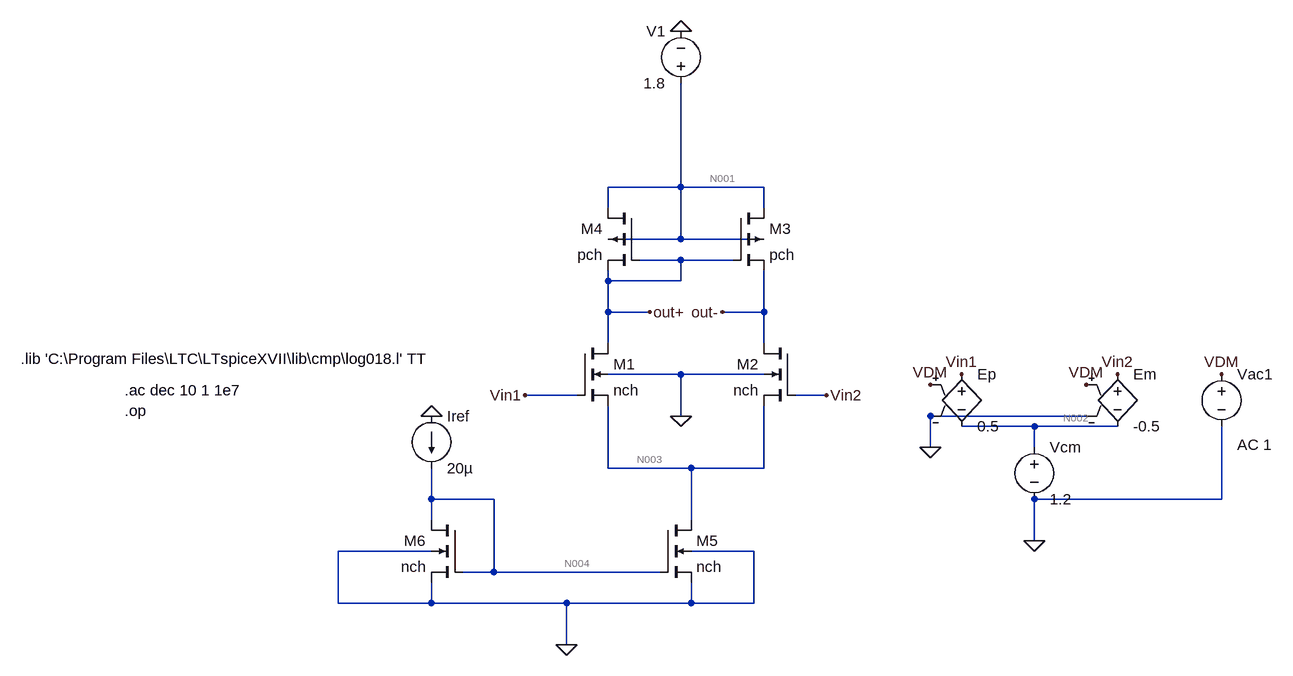
[diagram p0: schematic e3.1_dm.asc]
e3.1_dm.asc, the LTspice schematic file:
Version 4
SHEET 1 1180 692
WIRE 224 -32 224 -192
WIRE 224 -32 112 -32
WIRE 352 -32 224 -32
WIRE 112 0 112 -32
WIRE 352 0 352 -32
WIRE 224 48 224 -32
WIRE 224 48 112 48
WIRE 352 48 224 48
WIRE 224 80 160 80
WIRE 304 80 224 80
WIRE 112 112 112 96
WIRE 224 112 224 80
WIRE 224 112 112 112
WIRE 112 160 112 112
WIRE 176 160 112 160
WIRE 352 160 352 96
WIRE 352 160 288 160
WIRE 112 208 112 160
WIRE 352 208 352 160
WIRE 224 256 112 256
WIRE 352 256 224 256
WIRE 64 288 -16 288
WIRE 448 288 400 288
WIRE 224 320 224 256
WIRE 848 320 608 320
WIRE 768 336 656 336
WIRE 896 336 768 336
WIRE 608 368 608 320
WIRE 768 368 768 336
WIRE 112 400 112 304
WIRE 240 400 112 400
WIRE 352 400 352 304
WIRE 352 400 240 400
WIRE -160 448 -160 400
WIRE -64 448 -160 448
WIRE 1056 448 1056 336
WIRE 1056 448 768 448
WIRE -160 480 -160 448
WIRE 240 480 240 400
WIRE 768 512 768 448
WIRE -160 528 -304 528
WIRE 336 528 240 528
WIRE -64 560 -64 448
WIRE -64 560 -112 560
WIRE 192 560 -64 560
WIRE -304 608 -304 528
WIRE -160 608 -160 576
WIRE -160 608 -304 608
WIRE 48 608 -160 608
WIRE 240 608 240 576
WIRE 240 608 48 608
WIRE 336 608 336 528
WIRE 336 608 240 608
WIRE 48 672 48 608
FLAG 224 -272 0
FLAG -160 320 0
FLAG -16 288 Vin1
FLAG 448 288 Vin2
FLAG 768 512 0
FLAG 656 256 Vin1
FLAG 896 256 Vin2
FLAG 288 160 out-
FLAG 1056 256 VDM
FLAG 608 272 VDM
FLAG 848 272 VDM
FLAG 608 368 0
FLAG 224 320 0
FLAG 48 672 0
FLAG 176 160 out+
SYMBOL nmos4 64 208 R0
SYMATTR InstName M1
SYMATTR Value nch
SYMATTR Value2 l=0.18u w=0.25u
SYMBOL nmos4 400 208 M0
SYMATTR InstName M2
SYMATTR Value nch
SYMATTR Value2 l=0.18u w=0.25u
SYMBOL pmos4 304 0 R0
SYMATTR InstName M3
SYMATTR Value pch
SYMATTR Value2 l=0.5u w=2u
SYMBOL pmos4 160 0 M0
SYMATTR InstName M4
SYMATTR Value pch
SYMATTR Value2 l=0.5u w=2u
SYMBOL voltage 224 -176 R180
WINDOW 0 24 96 Left 2
WINDOW 3 24 16 Left 2
WINDOW 123 0 0 Left 0
WINDOW 39 0 0 Left 0
SYMATTR InstName V1
SYMATTR Value 1.8
SYMBOL nmos4 192 480 R0
SYMATTR InstName M5
SYMATTR Value nch
SYMATTR Value2 l=5u w=30u
SYMBOL nmos4 -112 480 M0
SYMATTR InstName M6
SYMATTR Value nch
SYMATTR Value2 l=5u w=15u
SYMBOL current -160 320 R0
WINDOW 123 0 0 Left 0
WINDOW 39 0 0 Left 0
SYMATTR InstName Iref
SYMATTR Value 20µ
SYMBOL voltage 768 352 R0
WINDOW 123 0 0 Left 0
WINDOW 39 0 0 Left 0
SYMATTR InstName Vcm
SYMATTR Value 1.2
SYMBOL e 656 240 R0
SYMATTR InstName Ep
SYMATTR Value 0.5
SYMBOL e 896 240 R0
SYMATTR InstName Em
SYMATTR Value -0.5
SYMBOL voltage 1056 240 R0
WINDOW 3 24 152 Left 2
WINDOW 123 24 124 Left 2
WINDOW 39 0 0 Left 0
SYMATTR Value ""
SYMATTR Value2 AC 1
SYMATTR InstName Vac1
TEXT -632 280 Left 2 !.ac dec 10 1 1e7
TEXT -632 312 Left 2 !.op
TEXT -792 232 Left 2 !.lib 'C:\\Program Files\\LTC\\LTspiceXVII\\lib\\cmp\\log018.l' TT

The netlist it stands for:
* e3.1_dm.asc
M1 out+ Vin1 N003 0 nch l=0.18u w=0.25u
M2 out- Vin2 N003 0 nch l=0.18u w=0.25u
M3 N001 out+ out- N001 pch l=0.5u w=2u
M4 N001 out+ out+ N001 pch l=0.5u w=2u
V1 N001 0 1.8
M5 N003 N004 0 0 nch l=5u w=30u
M6 N004 N004 0 0 nch l=5u w=15u
Iref 0 N004 20µ
Vcm N002 0 1.2
Ep Vin1 N002 VDM 0 0.5
Em Vin2 N002 VDM 0 -0.5
Vac1 VDM 0 AC 1
.model NMOS NMOS
.model PMOS PMOS
.lib standard.mos
.ac dec 10 1 1e7
.op
.lib 'C:\Program Files\LTC\LTspiceXVII\lib\cmp\log018.l' TT
.backanno
.end

* Results of the author's LTspice run, read from the files saved beside the schematic
* Operating Point, zero values left out:
*   V(out+) = 915.4 mV
*   V(vin1) = 1.2 V
*   V(n003) = 349.1 mV
*   V(out-) = 915.4 mV
*   V(vin2) = 1.2 V
*   V(n001) = 1.8 V
*   V(n004) = 615.3 mV
*   V(n002) = 1.2 V
*   Id(M6) = 20 µA
*   Is(M6) = -20 µA
*   Id(M5) = 39.73 µA
*   Is(M5) = -39.73 µA
*   Id(M4) = 19.87 µA
*   Is(M4) = -19.87 µA
*   Id(M3) = 19.87 µA
*   Is(M3) = -19.87 µA
*   Id(M2) = 19.87 µA
*   Ib(M2) = -1.285 pA
*   Is(M2) = -19.87 µA
*   Id(M1) = 19.87 µA
*   Ib(M1) = -1.285 pA
*   Is(M1) = -19.87 µA
*   I(Iref) = 20 µA
*   I(V1) = -39.73 µA
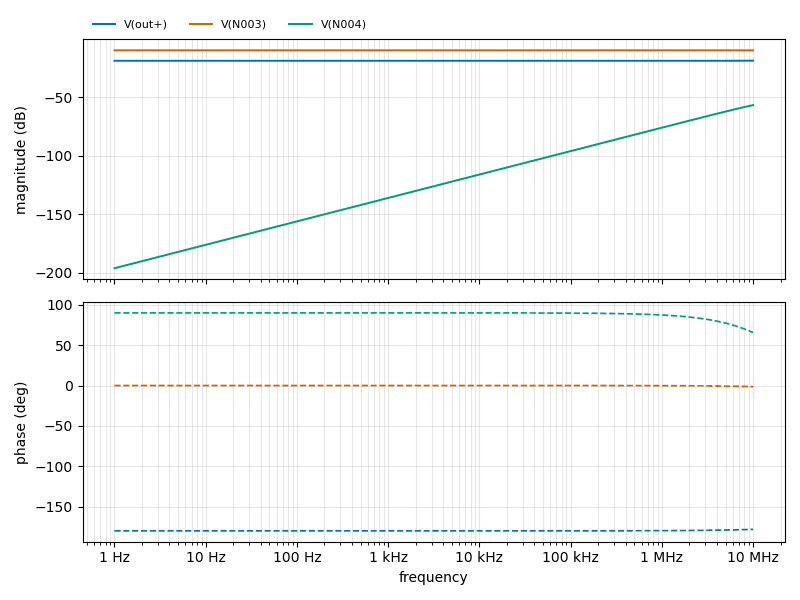
[diagram p1: AC Analysis of e3.1_dm.asc, plotted from the saved traces]
* AC Analysis, 1 run:
*   V(out+): -18.95 dB at 1 Hz, -18.84 dB at 10 MHz, peak -18.84 dB at 10 MHz
*   V(N003): -10.03 dB at 1 Hz, -10.06 dB at 10 MHz, peak -10.03 dB at 1 Hz
*   V(N004): -196.08 dB at 1 Hz, -56.81 dB at 10 MHz, peak -56.81 dB at 10 MHz, 3 dB below the peak at 6.772 MHz
* From the log:
*   Semiconductor Device Operating Points:
*                           --- BSIM3 MOSFETS ---
*   Name:        m6          m5          m4          m3          m2
*   Model:      nch.1       nch.1       pch.5       pch.5      nch.12
*   Id:        2.00e-05    3.97e-05    1.99e-05    1.99e-05    1.99e-05
*   Vgs:       6.15e-01    6.15e-01    0.00e+00    7.99e-15    8.51e-01
*   Vds:       6.15e-01    3.49e-01    8.85e-01    8.85e-01    5.66e-01
*   Vbs:       0.00e+00    0.00e+00    8.85e-01    8.85e-01   -3.49e-01
*   Vth:       4.45e-01    4.48e-01   -4.61e-01   -4.61e-01    5.96e-01
*   Vdsat:     2.07e-01    2.06e-01   -3.56e-01   -3.56e-01    1.98e-01
*   Gm:        1.90e-04    3.80e-04    8.21e-05    8.21e-05    1.03e-04
*   Gds:       3.02e-07    2.45e-06    1.31e-06    1.31e-06    6.19e-06
*   Gmb        5.50e-05    1.11e-04    2.83e-05    2.83e-05    2.23e-05
*   Cbd:       0.00e+00    0.00e+00    0.00e+00    0.00e+00    0.00e+00
*   Cbs:       0.00e+00    0.00e+00    0.00e+00    0.00e+00    0.00e+00
*   Cgsov:     5.49e-15    1.10e-14    6.46e-16    6.46e-16    8.43e-17
*   Cgdov:     5.49e-15    1.10e-14    6.46e-16    6.46e-16    8.43e-17
*   Cgbov:     9.11e-16    9.11e-16    1.36e-16    1.36e-16    3.18e-17
*   dQgdVgb:   4.27e-13    8.54e-13    7.92e-15    7.92e-15    4.60e-16
*   dQgdVdb:  -5.71e-15   -1.51e-14   -6.48e-16   -6.48e-16   -8.36e-17
*   dQgdVsb:  -3.76e-13   -7.49e-13   -6.86e-15   -6.86e-15   -3.04e-16
*   dQddVgb:  -6.68e-15   -2.25e-14   -6.57e-16   -6.57e-16   -8.52e-17
*   dQddVdb:   5.99e-15    1.83e-14    6.54e-16    6.54e-16    8.49e-17
*   dQddVsb:   1.03e-15    7.54e-15    6.86e-18    6.86e-18    5.12e-19
*   dQbdVgb:  -3.32e-14   -6.11e-14   -1.29e-15   -1.29e-15   -7.49e-17
*   dQbdVdb:  -2.85e-17   -6.42e-16   -1.87e-18   -1.87e-18    2.57e-20
*   dQbdVsb:  -1.22e-13   -2.49e-13   -8.84e-16   -8.84e-16   -4.30e-17
*   Name:        m1
*   Model:     nch.12
*   Id:        1.99e-05
*   Vgs:       8.51e-01
*   Vds:       5.66e-01
*   Vbs:      -3.49e-01
*   Vth:       5.96e-01
*   Vdsat:     1.98e-01
*   Gm:        1.03e-04
*   Gds:       6.19e-06
*   Gmb        2.23e-05
*   Cbd:       0.00e+00
*   Cbs:       0.00e+00
*   Cgsov:     8.43e-17
*   Cgdov:     8.43e-17
*   Cgbov:     3.18e-17
*   dQgdVgb:   4.60e-16
*   dQgdVdb:  -8.36e-17
*   dQgdVsb:  -3.04e-16
*   dQddVgb:  -8.52e-17
*   dQddVdb:   8.49e-17
*   dQddVsb:   5.12e-19
*   dQbdVgb:  -7.49e-17
*   dQbdVdb:   2.57e-20
*   dQbdVsb:  -4.30e-17